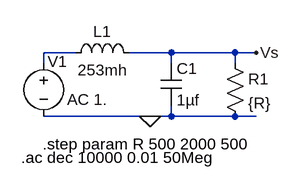
[diagram p0: schematic TP N°3 Analisis de alterna - Punto N°2.asc]
TP N°3 Analisis de alterna - Punto N°2.asc, the LTspice schematic file:
Version 4
SHEET 1 880 680
WIRE 400 112 352 112
WIRE 544 112 480 112
WIRE 640 112 544 112
WIRE 672 112 640 112
WIRE 352 128 352 112
WIRE 544 128 544 112
WIRE 640 128 640 112
WIRE 512 208 352 208
WIRE 544 208 544 192
WIRE 544 208 512 208
WIRE 640 208 544 208
WIRE 672 208 640 208
FLAG 672 112 Vs
FLAG 512 208 0
SYMBOL voltage 352 112 R0
WINDOW 0 6 14 Left 2
WINDOW 3 32 76 Left 2
WINDOW 123 35 71 Left 2
WINDOW 39 0 0 Left 0
SYMATTR InstName V1
SYMATTR Value ""
SYMATTR Value2 AC 1.
SYMBOL ind 384 128 R270
WINDOW 0 32 56 VTop 2
WINDOW 3 5 56 VBottom 2
SYMATTR InstName L1
SYMATTR Value 253mh
SYMBOL res 624 112 R0
SYMATTR InstName R1
SYMATTR Value {R}
SYMBOL cap 528 128 R0
SYMATTR InstName C1
SYMATTR Value 1µf
TEXT 350 250 Left 2 !.step param R 500 2000 500
TEXT 318 270 Left 2 !.ac dec 10000 0.01 50Meg

The netlist it stands for:
* TP N°3 Analisis de alterna - Punto N°2.asc
V1 N001 0 AC 1.
L1 N001 Vs 253mh
R1 Vs 0 {R}
C1 Vs 0 1µf
.step param R 500 2000 500
.ac dec 10000 0.01 50Meg
.backanno
.end